# Altium schematic sheet TCRT500_Sensors.SchDoc
size A; SheetNumber: 1; SheetTotal: 1
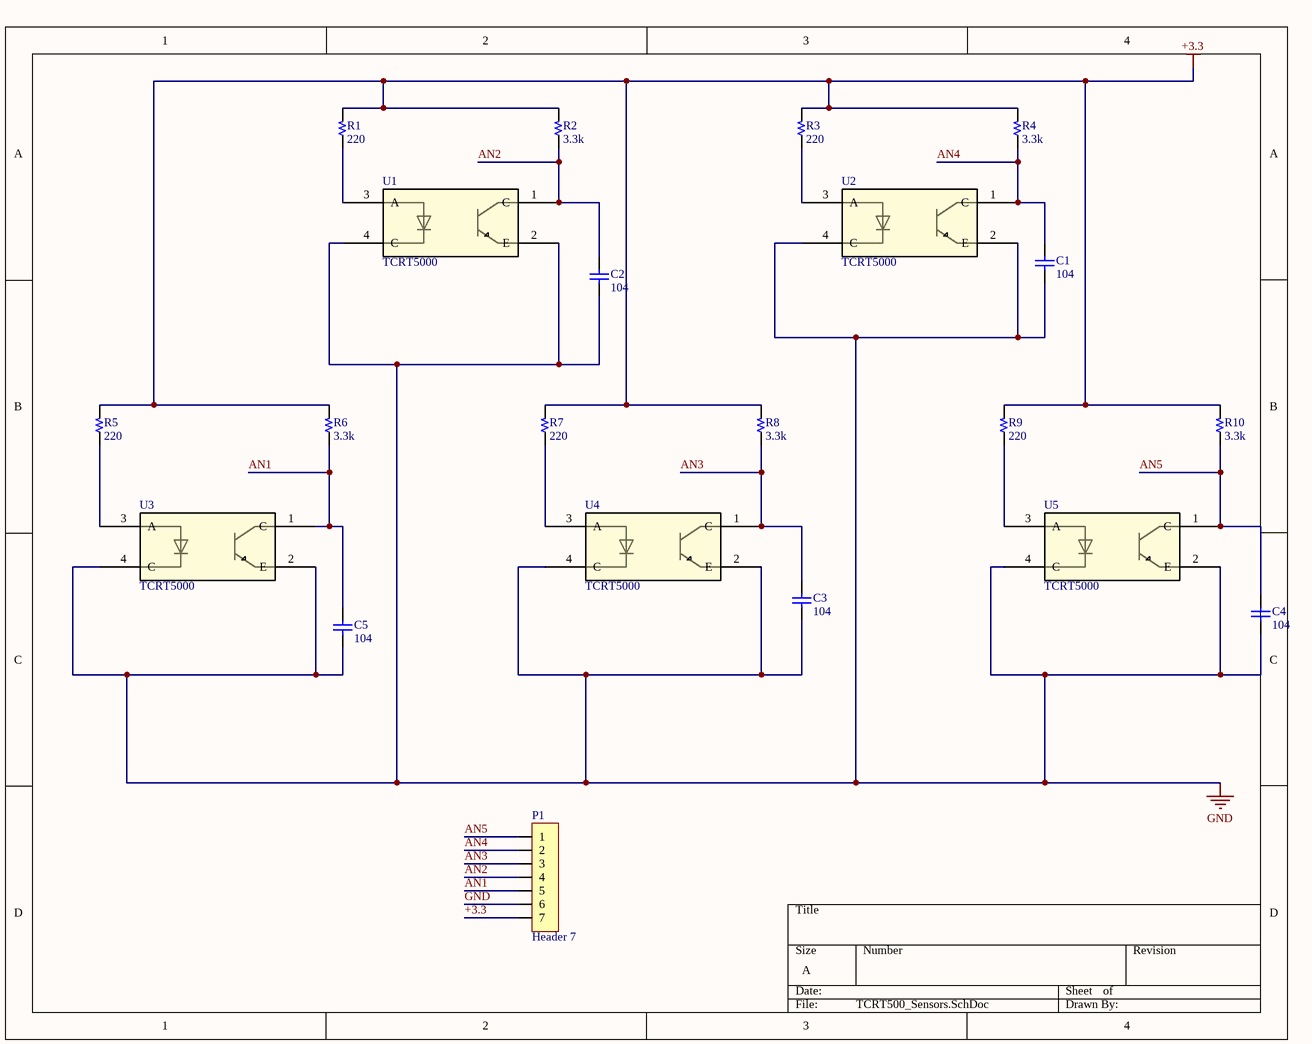
[diagram p0: TCRT500_Sensors.SchDoc]

## Parts
C1  104  [CAP Ceramic/W200]
C2  104  [CAP Ceramic/W200]
C3  104  [CAP Ceramic/W200]
C4  104  [CAP Ceramic/W200]
C5  104  [CAP Ceramic/W200]
P1  Header 7  [HDR/Header/7]
R1  220  [R 1/4W/300]
R2  3.3k  [R 1/4W/300]
R3  220  [R 1/4W/300]
R4  3.3k  [R 1/4W/300]
R5  220  [R 1/4W/300]
R6  3.3k  [R 1/4W/300]
R7  220  [R 1/4W/300]
R8  3.3k  [R 1/4W/300]
R9  220  [R 1/4W/300]
R10  3.3k  [R 1/4W/300]
U1  TCRT5000  [TCRT5000]
U2  TCRT5000  [TCRT5000]
U3  TCRT5000  [TCRT5000]
U4  TCRT5000  [TCRT5000]
U5  TCRT5000  [TCRT5000]

## Nets
+3.3: P1.7 R1.2 R2.2 R3.2 R4.2 R5.2 R6.2 R7.2 R8.2 R9.2 R10.2
GND: C1.2 C2.2 C3.2 C4.2 C5.2 P1.6 U1.2(E) U1.4(C) U2.2(E) U2.4(C) U3.2(E) U3.4(C) U4.2(E) U4.4(C) U5.2(E) U5.4(C)
AN1: C5.1 P1.5 R6.1 U3.1(C)
AN2: C2.1 P1.4 R2.1 U1.1(C)
AN3: C3.1 P1.3 R8.1 U4.1(C)
AN4: C1.1 P1.2 R4.1 U2.1(C)
AN5: C4.1 P1.1 R10.1 U5.1(C)
NetR1_1: R1.1 U1.3(A)
NetR3_1: R3.1 U2.3(A)
NetR5_1: R5.1 U3.3(A)
NetR7_1: R7.1 U4.3(A)
NetR9_1: R9.1 U5.3(A)

## Library data of the parts
C1-C5 = Capacitor NP: Capacitor non-pol
P1 = Header 7: Header, 7-Pin
R1-R10 = Resistor
U1-U5 = TCRT5000: SENSOR REFL, LENSES, CONVER. AXES-e2; Manufacturer_Name: Vishay; Copyright: Copyright (C) 2025 Ultra Librarian. All rights reserved.; Manufacturer_Part_Number: TCRT5000; RefDes: RefDes; Type: Type